# Altium schematic sheet Schemat.SchDoc
size A4
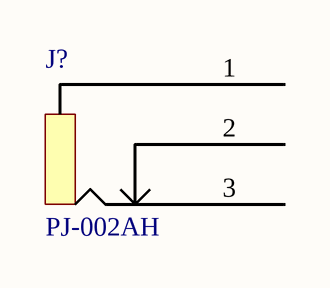
[diagram p0: Schemat.SchDoc]

## Parts
J?  Supplier Part Number 1: PJ-002AH  (hidden comment: PJ-002AH-SMT)

## Nets

Not connected (* = marked no-connect by the designer): J? 1 2 3

## Library data of the parts
J? = PJ-002AH-SMT: DC Power Jack; Supplier 1: NAC Semi; HelpURL: http://www.cui.com/product/resource/pj-102a.pdf